# EAGLE schematic SmartLEDShield_V4 (EAGLE 7.7.0)
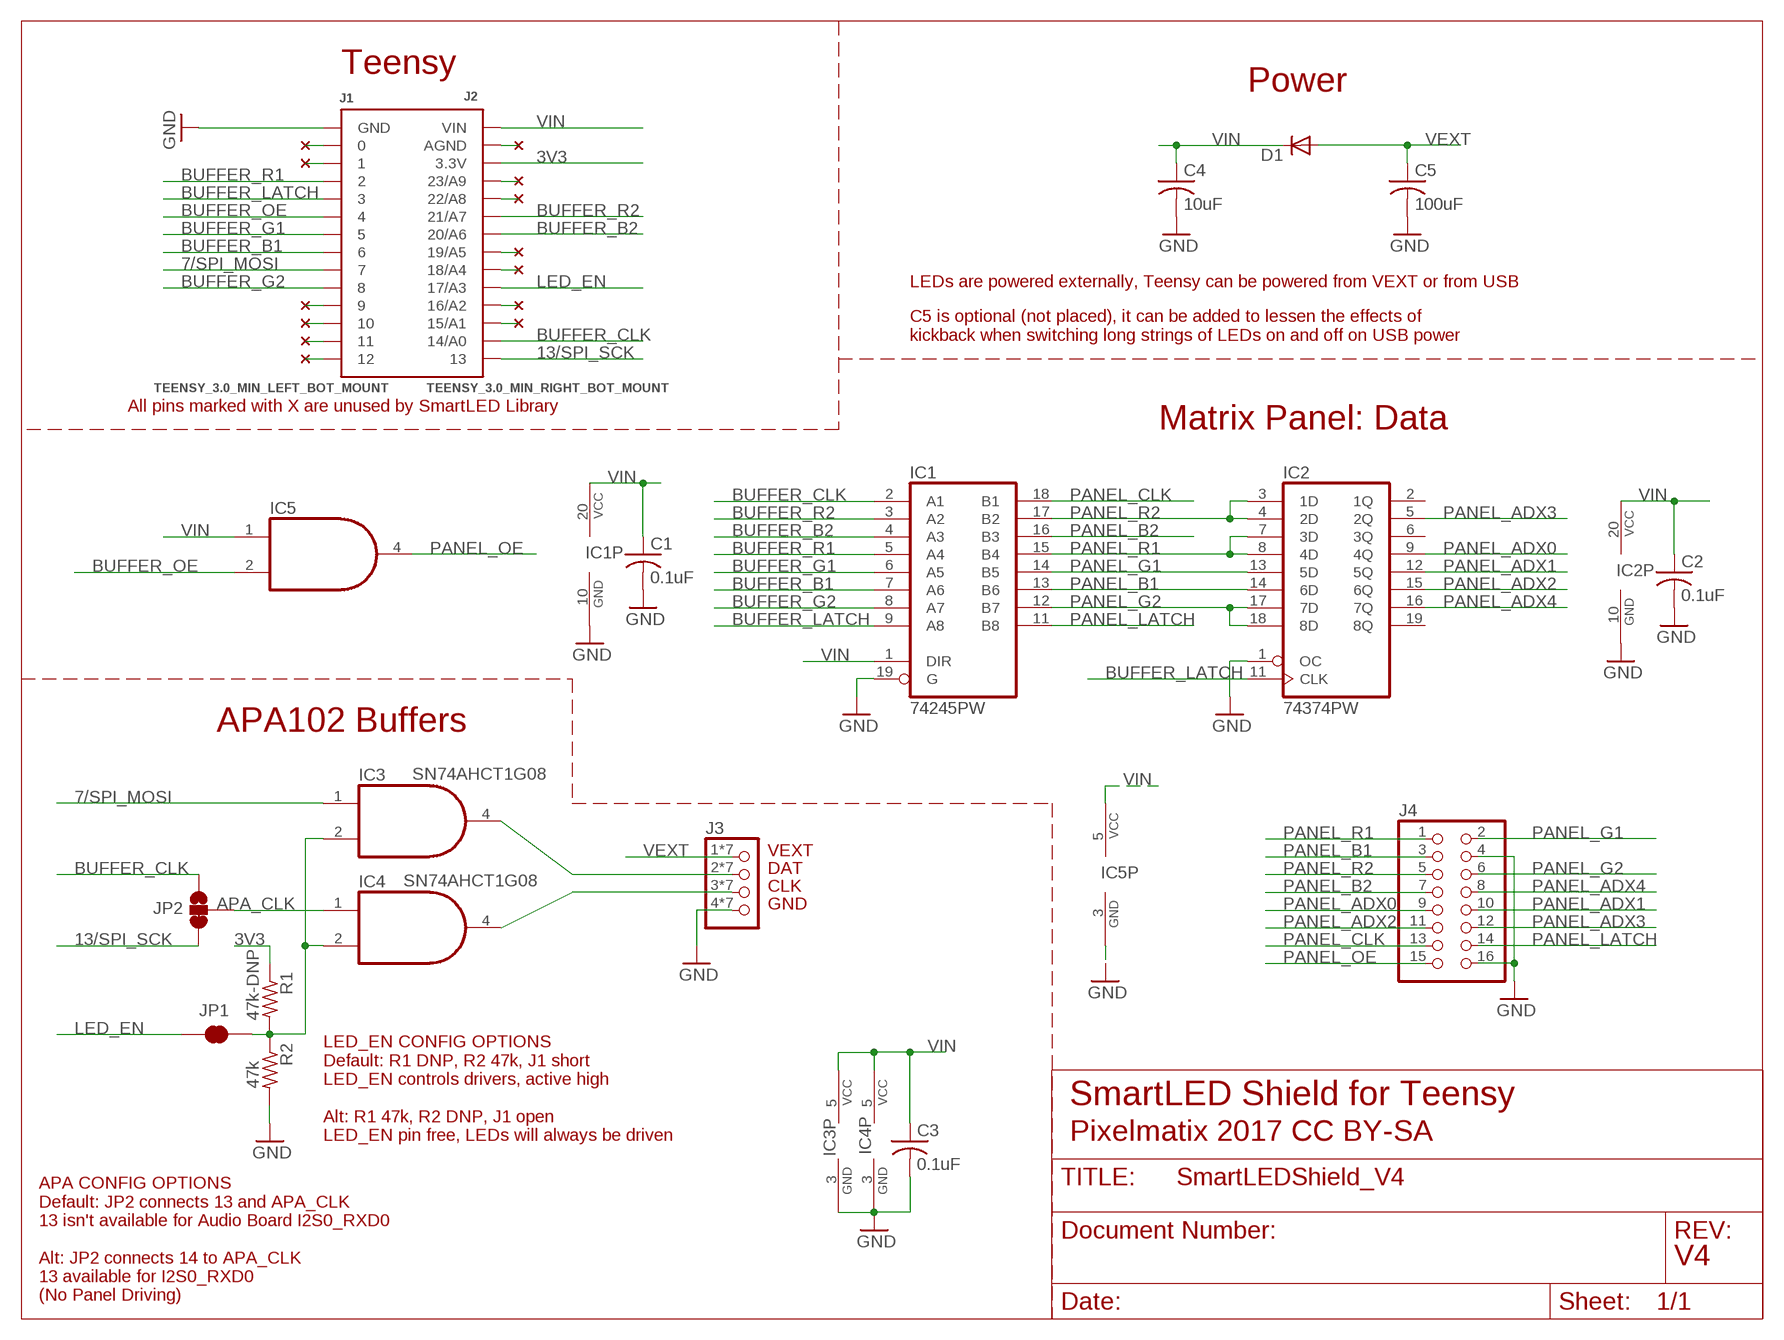
[diagram p0: schematic, sheet 1]

## Parts
C1  0.1uF  C-USC0603  [C0603]
C2  0.1uF  C-USC0603  [C0603]
C3  0.1uF  C-USC0603  [C0603]
C4  10uF  C-USC0805  [C0805]
C5  100uF  C-USC1206  [C1206]
D1  MBR0520LT  [SOD123]
IC1  74245PW  [TSSOP-20]
IC2  74374PW  [TSSOP-20]
IC3  74AHC1G08DBV  [SOT23-5]
IC4  74AHC1G08DBV  [SOT23-5]
IC5  74AHC1G08DBV  [SOT23-5]
J1  TEENSY_3.0_MIN_LEFT_BOT_MOUNT  [TEENSY_DUAL_HEADER_BOT_MOUNT_LEFT]
J2  TEENSY_3.0_MIN_RIGHT_BOT_MOUNT  [TEENSY_DUAL_HEADER_BOT_MOUNT_RIGHT]
J3  PINHD-1X04_WIREPADS_NARROW  [1X04SMDWIRES_NARROW]
J4  PINHD-2X08_SMARTMATRIX_SSMTHT  [SMARTMATRIX_SSMTHT]
JP1  JUMPER-SMT_2_NC_TRACE_NO-SILK  [SMT-JUMPER_2_NC_TRACE_NO-SILK]
JP2  JUMPER-SMT_3_1-NC_TRACE_SILK  [SMT-JUMPER_3_1-NC_TRACE_SILK]
R1  47k-DNP  R-US_R0603  [R0603]
R2  47k  R-US_R0603  [R0603]
U$1  NC  (no package)
U$2  NC  (no package)
U$3  NC  (no package)
U$4  NC  (no package)
U$6  NC  (no package)
U$7  NC  (no package)
U$8  NC  (no package)
U$9  NC  (no package)
U$10  NC  (no package)
U$11  NC  (no package)
U$13  NC  (no package)
U$14  NC  (no package)
U$15  NC  (no package)

## Nets
3V3 [power]: J2.3V3_A(3.3V) J2.3V3_B(3.3V) R1.1
7/SPI_MOSI: IC3.1(I0) J1.7A J1.7B
13/SPI_SCK: J2.13A J2.13B JP2.3
APA_CLK: IC4.1(I0) JP2.2
BUFFER_B1: IC1.7(A6) J1.6A J1.6B
BUFFER_B2: IC1.4(A3) J2.20A(20/A6) J2.20B(20/A6)
BUFFER_CLK: IC1.2(A1) J2.14A(14/A0) J2.14B(14/A0) JP2.1
BUFFER_G1: IC1.6(A5) J1.5A J1.5B
BUFFER_G2: IC1.8(A7) J1.8A J1.8B
BUFFER_LATCH: IC1.9(A8) IC2.11(CLK) J1.3A J1.3B
BUFFER_OE: IC5.2(I1) J1.4A J1.4B
BUFFER_R1: IC1.5(A4) J1.2A J1.2B
BUFFER_R2: IC1.3(A2) J2.21A(21/A7) J2.21B(21/A7)
CLK1: IC4.4(O) J3.3 J3.3-1 J3.3-2 J3.3-3 J3.3-4 J3.3-5 J3.3-6
DAT1: IC3.4(O) J3.2 J3.2-1 J3.2-2 J3.2-3 J3.2-4 J3.2-5 J3.2-6
GND: C1.2 C2.2 C3.2 C4.2 C5.2 IC1.10(GND) IC1.19(G) IC2.1(OC) IC2.10(GND) IC3.3(GND) IC4.3(GND) IC5.3(GND) J1.GNDA(GND) J1.GNDB(GND) J3.4 J3.4-1 J3.4-2 J3.4-3 J3.4-4 J3.4-5 J3.4-6 J4.4 J4.16 R2.2
LED_EN: J2.17A(17/A3) J2.17B(17/A3) JP1.1
N$1: J1.0A J1.0B U$1.P$1
N$2: J1.9A J1.9B U$6.P$1
N$3: J1.10A J1.10B U$7.P$1
N$4: IC3.2(I1) IC4.2(I1) JP1.2 R1.2 R2.1
N$5: J1.1A J1.1B U$4.P$1
N$6: J2.AGND_A(AGND) J2.AGND_B(AGND) U$8.P$1
N$7: J2.19A(19/A5) J2.19B(19/A5) U$9.P$1
N$8: J2.22A(22/A8) J2.22B(22/A8) U$10.P$1
N$9: J2.18A(18/A4) J2.18B(18/A4) U$11.P$1
N$10: J2.23A(23/A9) J2.23B(23/A9) U$3.P$1
N$11: J2.16A(16/A2) J2.16B(16/A2) U$13.P$1
N$12: J2.15A(15/A1) J2.15B(15/A1) U$14.P$1
N$13: J1.12A J1.12B U$15.P$1
N$14: J1.11A J1.11B U$2.P$1
PANEL_ADX0: IC2.9(4Q) J4.9
PANEL_ADX1: IC2.12(5Q) J4.10
PANEL_ADX2: IC2.15(6Q) J4.11
PANEL_ADX3: IC2.5(2Q) J4.12
PANEL_ADX4: IC2.16(7Q) J4.8
PANEL_B1: IC1.13(B6) IC2.14(6D) J4.3
PANEL_B2: IC1.16(B3) J4.7
PANEL_CLK: IC1.18(B1) J4.13
PANEL_G1: IC1.14(B5) IC2.13(5D) J4.2
PANEL_G2: IC1.12(B7) IC2.17(7D) IC2.18(8D) J4.6
PANEL_LATCH: IC1.11(B8) J4.14
PANEL_OE: IC5.4(O) J4.15
PANEL_R1: IC1.15(B4) IC2.7(3D) IC2.8(4D) J4.1
PANEL_R2: IC1.17(B2) IC2.3(1D) IC2.4(2D) J4.5
VEXT: C5.1 D1.A J3.1 J3.1-1 J3.1-2 J3.1-3 J3.1-4 J3.1-5 J3.1-6
VIN: C1.1 C2.1 C3.1 C4.1 D1.C IC1.1(DIR) IC1.20(VCC) IC2.20(VCC) IC3.5(VCC) IC4.5(VCC) IC5.1(I0) IC5.5(VCC) J2.VIN_A(VIN) J2.VIN_B(VIN)
Unconnected: IC2.2(1Q) IC2.6(3Q) IC2.19(8Q)

## Notes on the sheet
- Teensy
- Power
- LEDs are powered externally, Teensy can be powered from VEXT or from USB
- C5 is optional (not placed), it can be added to lessen the effects of
  kickback when switching long strings of LEDs on and off on USB power
- All pins marked with X are unused by SmartLED Library
- Matrix Panel: Data
- APA102 Buffers
- SN74AHCT1G08
- VEXT
- DAT
- SN74AHCT1G08
- CLK
- GND
- SmartLED Shield for Teensy
- LED_EN CONFIG OPTIONS
  Default: R1 DNP, R2 47k, J1 short
  LED_EN controls drivers, active high
  
  Alt: R1 47k, R2 DNP, J1 open
  LED_EN pin free, LEDs will always be driven
- Pixelmatix 2017 CC BY-SA
- V4
- APA CONFIG OPTIONS
  Default: JP2 connects 13 and APA_CLK
  13 isn't available for Audio Board I2S0_RXD0
  
  Alt: JP2 connects 14 to APA_CLK
  13 available for I2S0_RXD0
  (No Panel Driving)

## Library data of the parts
C1-C5 = scanlime:C-US: CAPACITOR, American symbol; PARTNO: CAP CER 0.1UF 10V 10% X7R 0805
D1 = diode:MBR0520LT: SCHOTTKY BARRIER RECTIFIER Source: http://onsemi.com .. MBR0520LT1-D.pdf
IC1 = eclibrary:74*245: Octal BUS TRANSCEIVER, 3-state
IC2 = eclibrary:74*374: Octal D type transparent LATCH, edge triggered
IC3-IC5 = 74xx-little-us:74*1G08: 2-input AND gate
J1 = eclibrary:TEENSY_3.0_MIN_LEFT
J2 = eclibrary:TEENSY_3.0_MIN_RIGHT
J3 = eclibrary:PINHD-1X04: PIN HEADER
J4 = eclibrary:PINHD-2X08: PIN HEADER
JP1 = SparkFun-Jumpers:JUMPER-SMT_2_NC_TRACE: Normally closed trace jumper This jumper has a trace between two pads so it's normally closed (NC). Use a razor knife to open the connection. For best results follow the IPC guidelines for cutting traces: Cutout at least 0.063 mm (0.005 in). Remove all loose material to clean up the cut area. Seal the cut with an approved epoxy. Reapply solder to reclose the connection.
JP2 = SparkFun-Jumpers:JUMPER-SMT_3_1-NC_TRACE: Normally closed trace jumper (1 of 2 connections) This jumper has a trace between two pads so it's normally closed (NC). The other connection is normally open (NO). Use a razor knife to open the connection. For best results follow the IPC guidelines for cutting traces: Cutout at least 0.063 mm (0.005 in). Remove all loose material to clean up the cut area. Seal the cut with an approved epoxy. Reapply solder to reclose the connection, or to close the NO connection.
R1 R2 = rcl:R-US_: RESISTOR, American symbol
U$1-U$4 U$6-U$11 U$13-U$15 = eclibrary:NC

## Net classes
0 default: width 0.254 mm
1 power: width 0.406 mm